# EasyEDA Pro project link board.eprj

# Schematic Schematic1
Create Date: 2024-04-27; Page Name: P1; Project Name: link board; Schematic Name: Schematic1; Update Date: 2025-11-03; Company: 嘉立创EDA; Page Size: A4; Version: V1.0
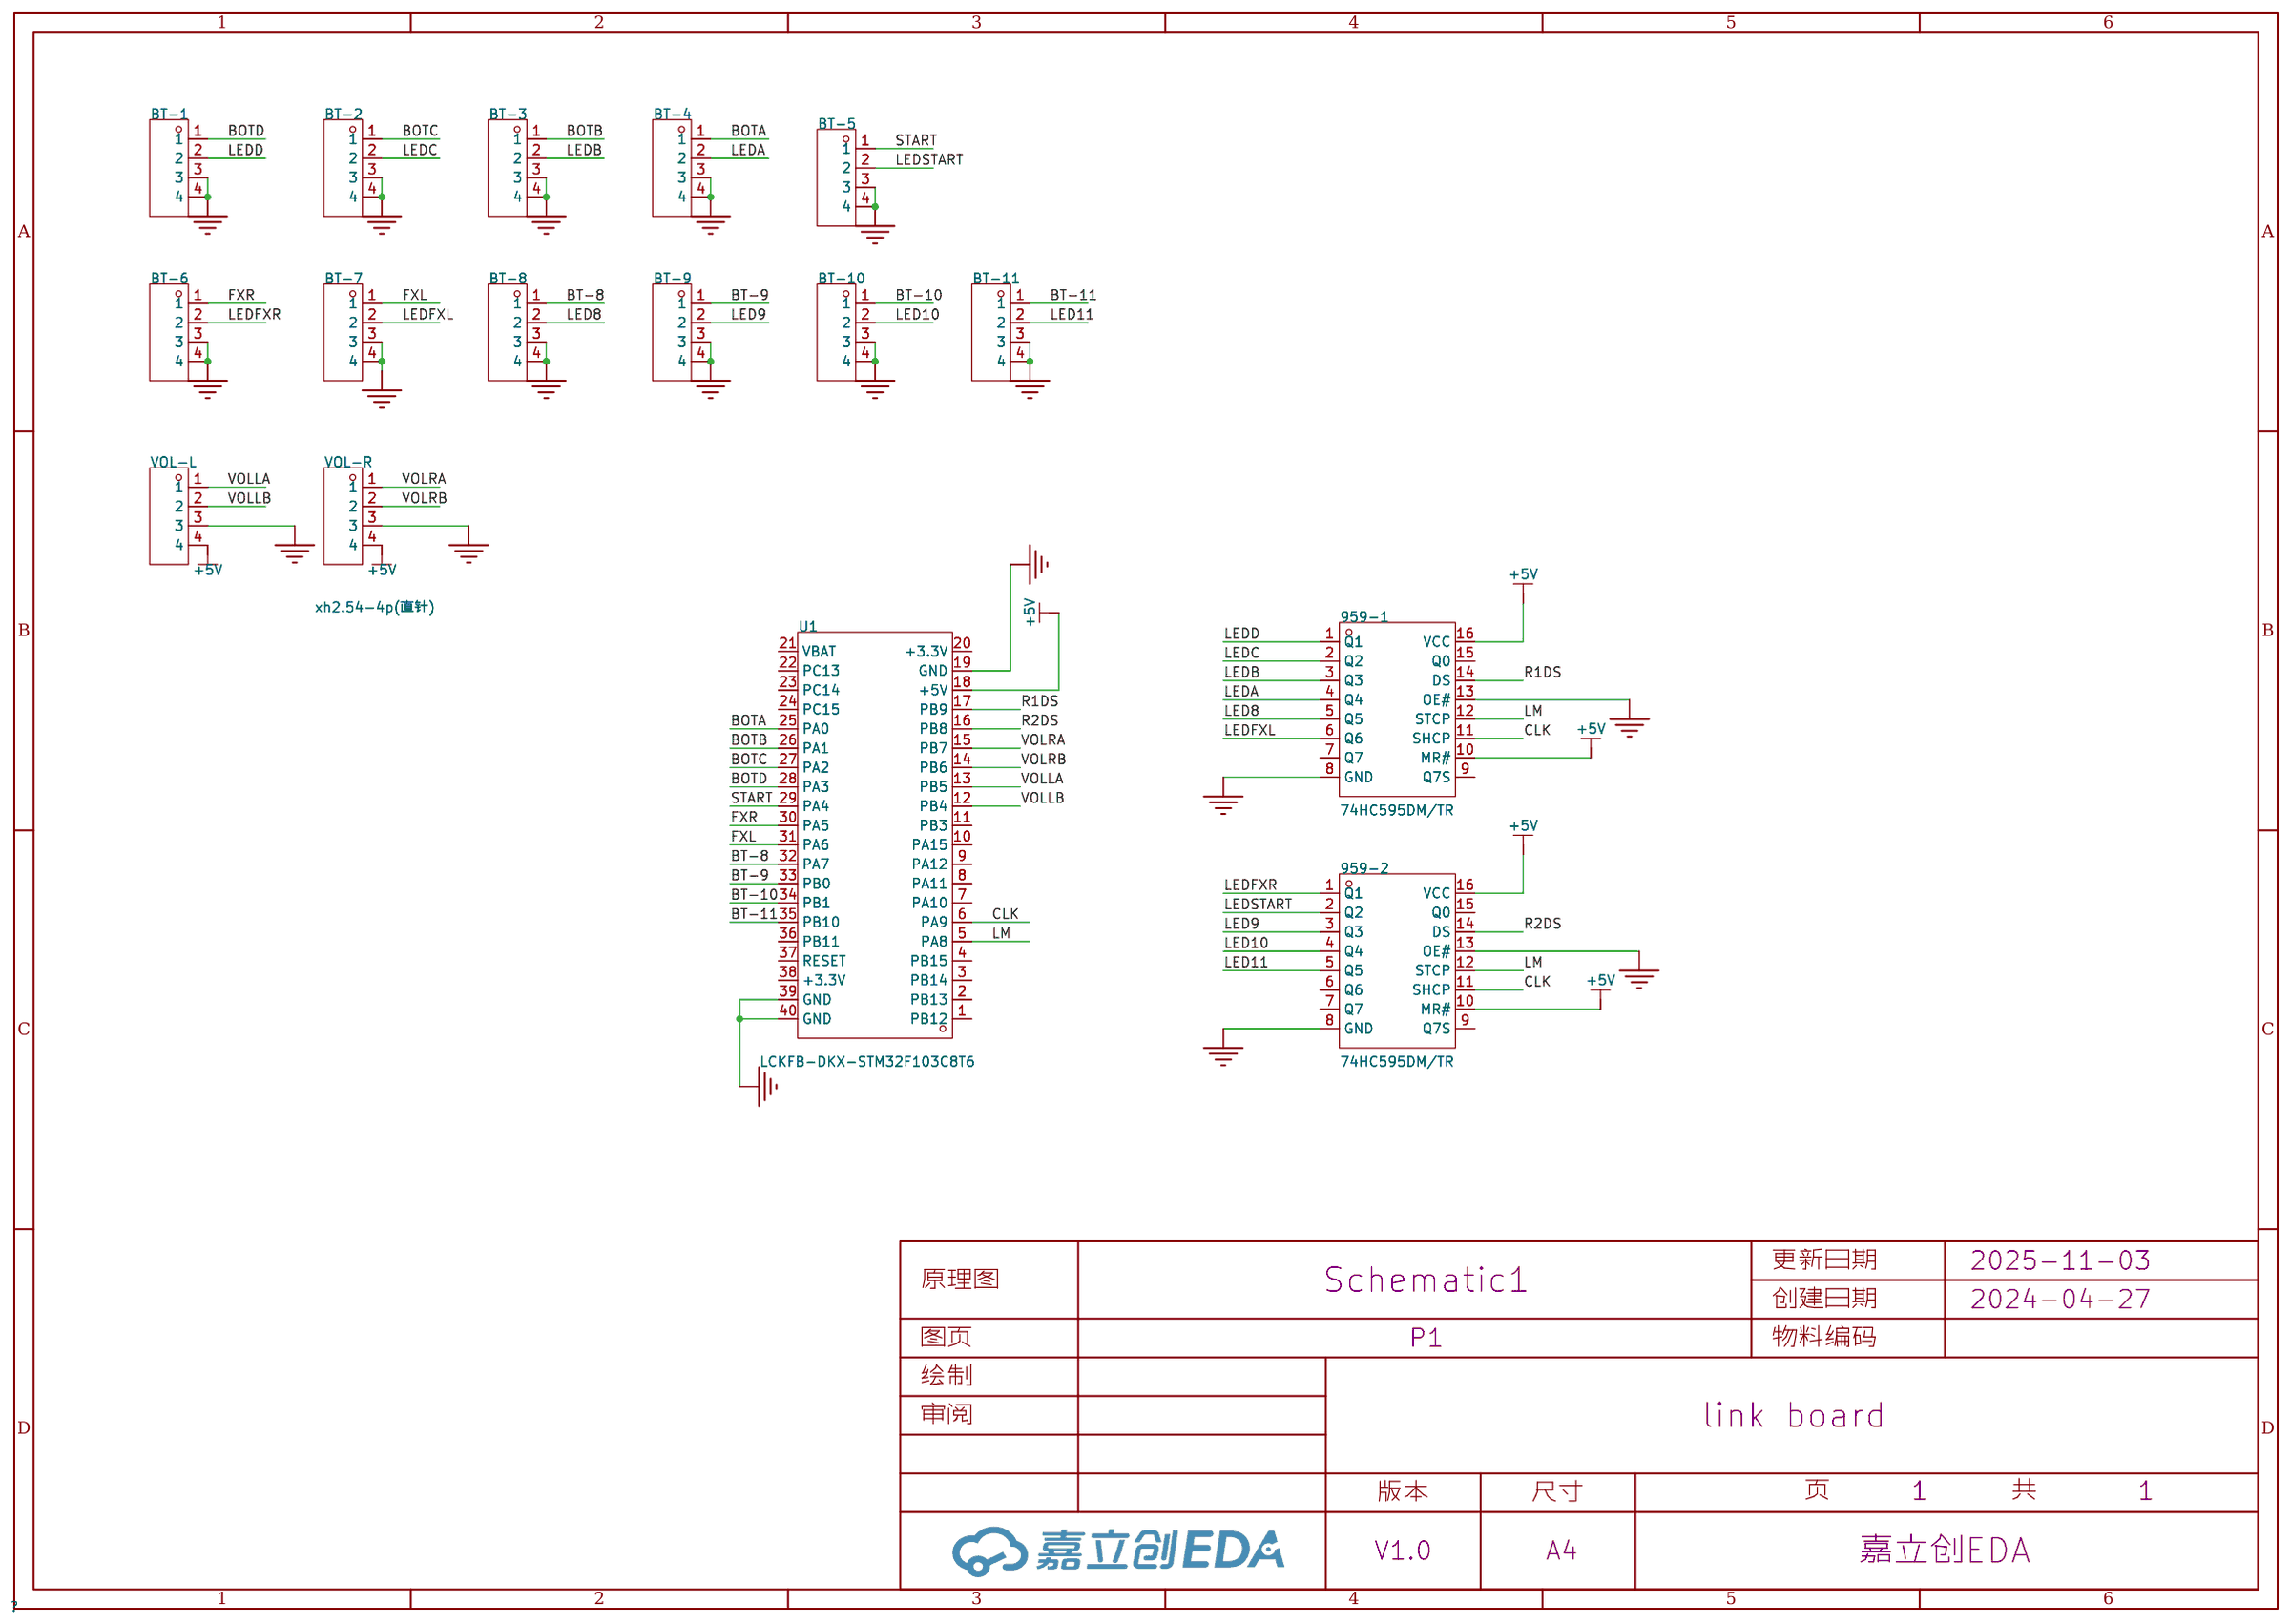
[diagram p0: schematic sheet]

## Parts
959-1  74HC595DM/TR  [SOP-16_L9.9-W3.9-P1.27-LS6.0-BL]
959-2  74HC595DM/TR  [SOP-16_L9.9-W3.9-P1.27-LS6.0-BL]
BT-1  xh2.54-4p(直针)  [CONN-TH_4P-P2.50-XH2.54-4P]
BT-2  xh2.54-4p(直针)  [CONN-TH_4P-P2.50-XH2.54-4P]
BT-3  xh2.54-4p(直针)  [CONN-TH_4P-P2.50-XH2.54-4P]
BT-4  xh2.54-4p(直针)  [CONN-TH_4P-P2.50-XH2.54-4P]
BT-5  xh2.54-4p(直针)  [CONN-TH_4P-P2.50-XH2.54-4P]
BT-6  xh2.54-4p(直针)  [CONN-TH_4P-P2.50-XH2.54-4P]
BT-7  xh2.54-4p(直针)  [CONN-TH_4P-P2.50-XH2.54-4P]
BT-8  xh2.54-4p(直针)  [CONN-TH_4P-P2.50-XH2.54-4P]
BT-9  xh2.54-4p(直针)  [CONN-TH_4P-P2.50-XH2.54-4P]
BT-10  xh2.54-4p(直针)  [CONN-TH_4P-P2.50-XH2.54-4P]
BT-11  xh2.54-4p(直针)  [CONN-TH_4P-P2.50-XH2.54-4P]
U1  LCKFB-DKX-STM32F103C8T6  [CONN-TH_L53.3-W22.9_STM32F103C8T6-CARD]
VOL-L  xh2.54-4p(直针)  [CONN-TH_4P-P2.50-XH2.54-4P]
VOL-R  xh2.54-4p(直针)  [CONN-TH_4P-P2.50-XH2.54-4P]

## Library data of the parts
959-1 959-2 = 74HC595DM/TR: 每个元件位数:8;; Supplier Part: C5310886; Manufacturer: HGSEMI(华冠); Supplier Footprint: SOP-16; JLCPCB Part Class: 扩展库; Datasheet: https://atta.szlcsc.com/upload/public/pdf/source/20230411/38690329BA06CC7DD5353F2E6349E43B.pdf; Supplier: LCSC; Number of Bits per Element: 8; Series: 74HC
BT-1-BT-11 VOL-L VOL-R = xh2.54-4p(直针): Supplier Part: C9900015350; JLCPCB Part Class: 扩展库; Supplier: LCSC
U1 = LCKFB-DKX-STM32F103C8T6: LCSC Part Name: 立创·地阔星-STM32F103C8T6开发板; Supplier Part: C22396880; Manufacturer: 立创开发板; JLCPCB Part Class: 扩展库; Datasheet: https://atta.szlcsc.com/upload/public/pdf/source/20240801/7EEF69F7480DF7C6DA98696664D658D4.pdf; Supplier: LCSC

## Nets
+5V: 959-1.10(MR#) 959-1.16(VCC) 959-2.10(MR#) 959-2.16(VCC) U1.18(+5V) VOL-L.4 VOL-R.4
GND: 959-1.8(GND) 959-1.13(OE#) 959-2.8(GND) 959-2.13(OE#) BT-1.3 BT-1.4 BT-2.3 BT-2.4 BT-3.3 BT-3.4 BT-4.3 BT-4.4 BT-5.3 BT-5.4 BT-6.3 BT-6.4 BT-7.3 BT-7.4 BT-8.3 BT-8.4 BT-9.3 BT-9.4 BT-10.3 BT-10.4 BT-11.3 BT-11.4 U1.19(GND) U1.39(GND) U1.40(GND) VOL-L.3 VOL-R.3
BOTA: BT-4.1 U1.25(PA0)
BOTB: BT-3.1 U1.26(PA1)
BOTC: BT-2.1 U1.27(PA2)
BOTD: BT-1.1 U1.28(PA3)
BT-8: BT-8.1 U1.32(PA7)
BT-9: BT-9.1 U1.33(PB0)
BT-10: BT-10.1 U1.34(PB1)
BT-11: BT-11.1 U1.35(PB10)
CLK: 959-1.11(SHCP) 959-2.11(SHCP) U1.6(PA9)
FXL: BT-7.1 U1.31(PA6)
FXR: BT-6.1 U1.30(PA5)
LED8: 959-1.5(Q5) BT-8.2
LED9: 959-2.3(Q3) BT-9.2
LED10: 959-2.4(Q4) BT-10.2
LED11: 959-2.5(Q5) BT-11.2
LEDA: 959-1.4(Q4) BT-4.2
LEDB: 959-1.3(Q3) BT-3.2
LEDC: 959-1.2(Q2) BT-2.2
LEDD: 959-1.1(Q1) BT-1.2
LEDFXL: 959-1.6(Q6) BT-7.2
LEDFXR: 959-2.1(Q1) BT-6.2
LEDSTART: 959-2.2(Q2) BT-5.2
LM: 959-1.12(STCP) 959-2.12(STCP) U1.5(PA8)
R1DS: 959-1.14(DS) U1.17(PB9)
R2DS: 959-2.14(DS) U1.16(PB8)
START: BT-5.1 U1.29(PA4)
VOLLA: U1.13(PB5) VOL-L.1
VOLLB: U1.12(PB4) VOL-L.2
VOLRA: U1.15(PB7) VOL-R.1
VOLRB: U1.14(PB6) VOL-R.2

Not connected (* = marked no-connect by the designer): 959-1 7(Q7) 9(Q7S) 15(Q0); 959-2 6(Q6) 7(Q7) 9(Q7S) 15(Q0); U1 1(PB12) 2(PB13) 3(PB14) 4(PB15) 7(PA10) 8(PA11) 9(PA12) 10(PA15) 11(PB3) 20(+3.3V) 21(VBAT) 22(PC13) 23(PC14) 24(PC15) 36(PB11) 37(RESET) 38(+3.3V)

# Board PCB1
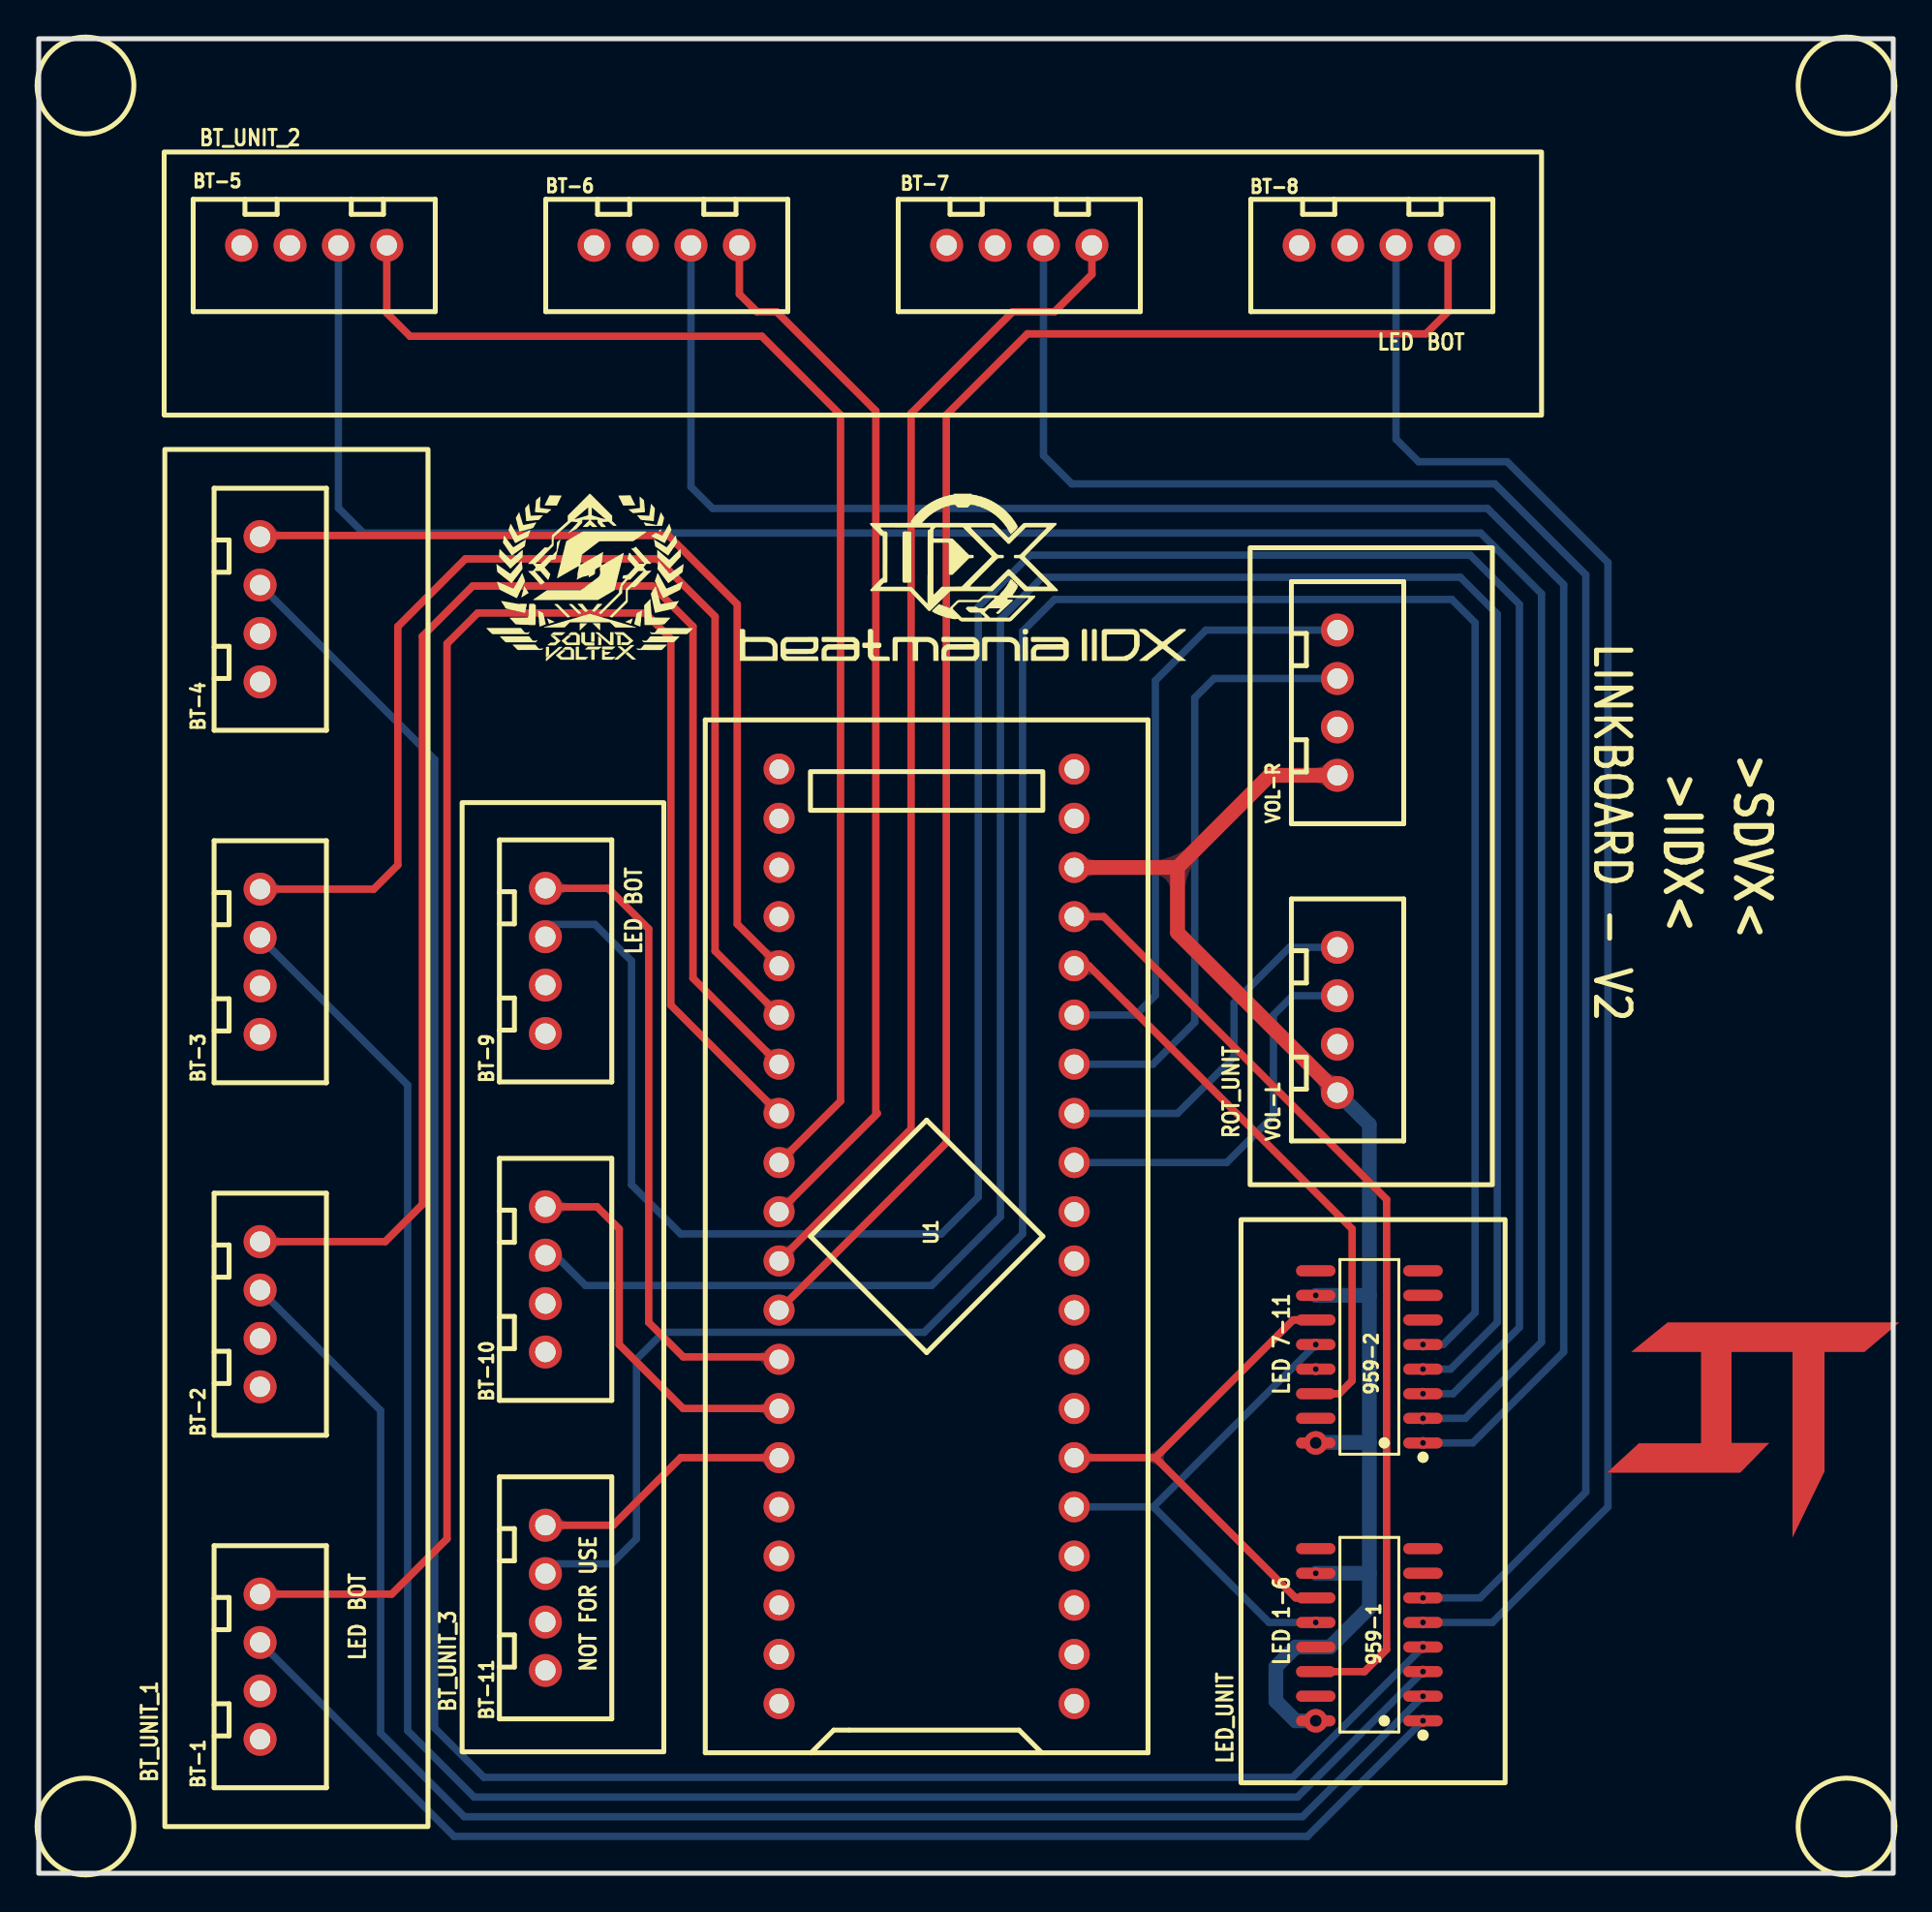
[diagram p1: board, top side]
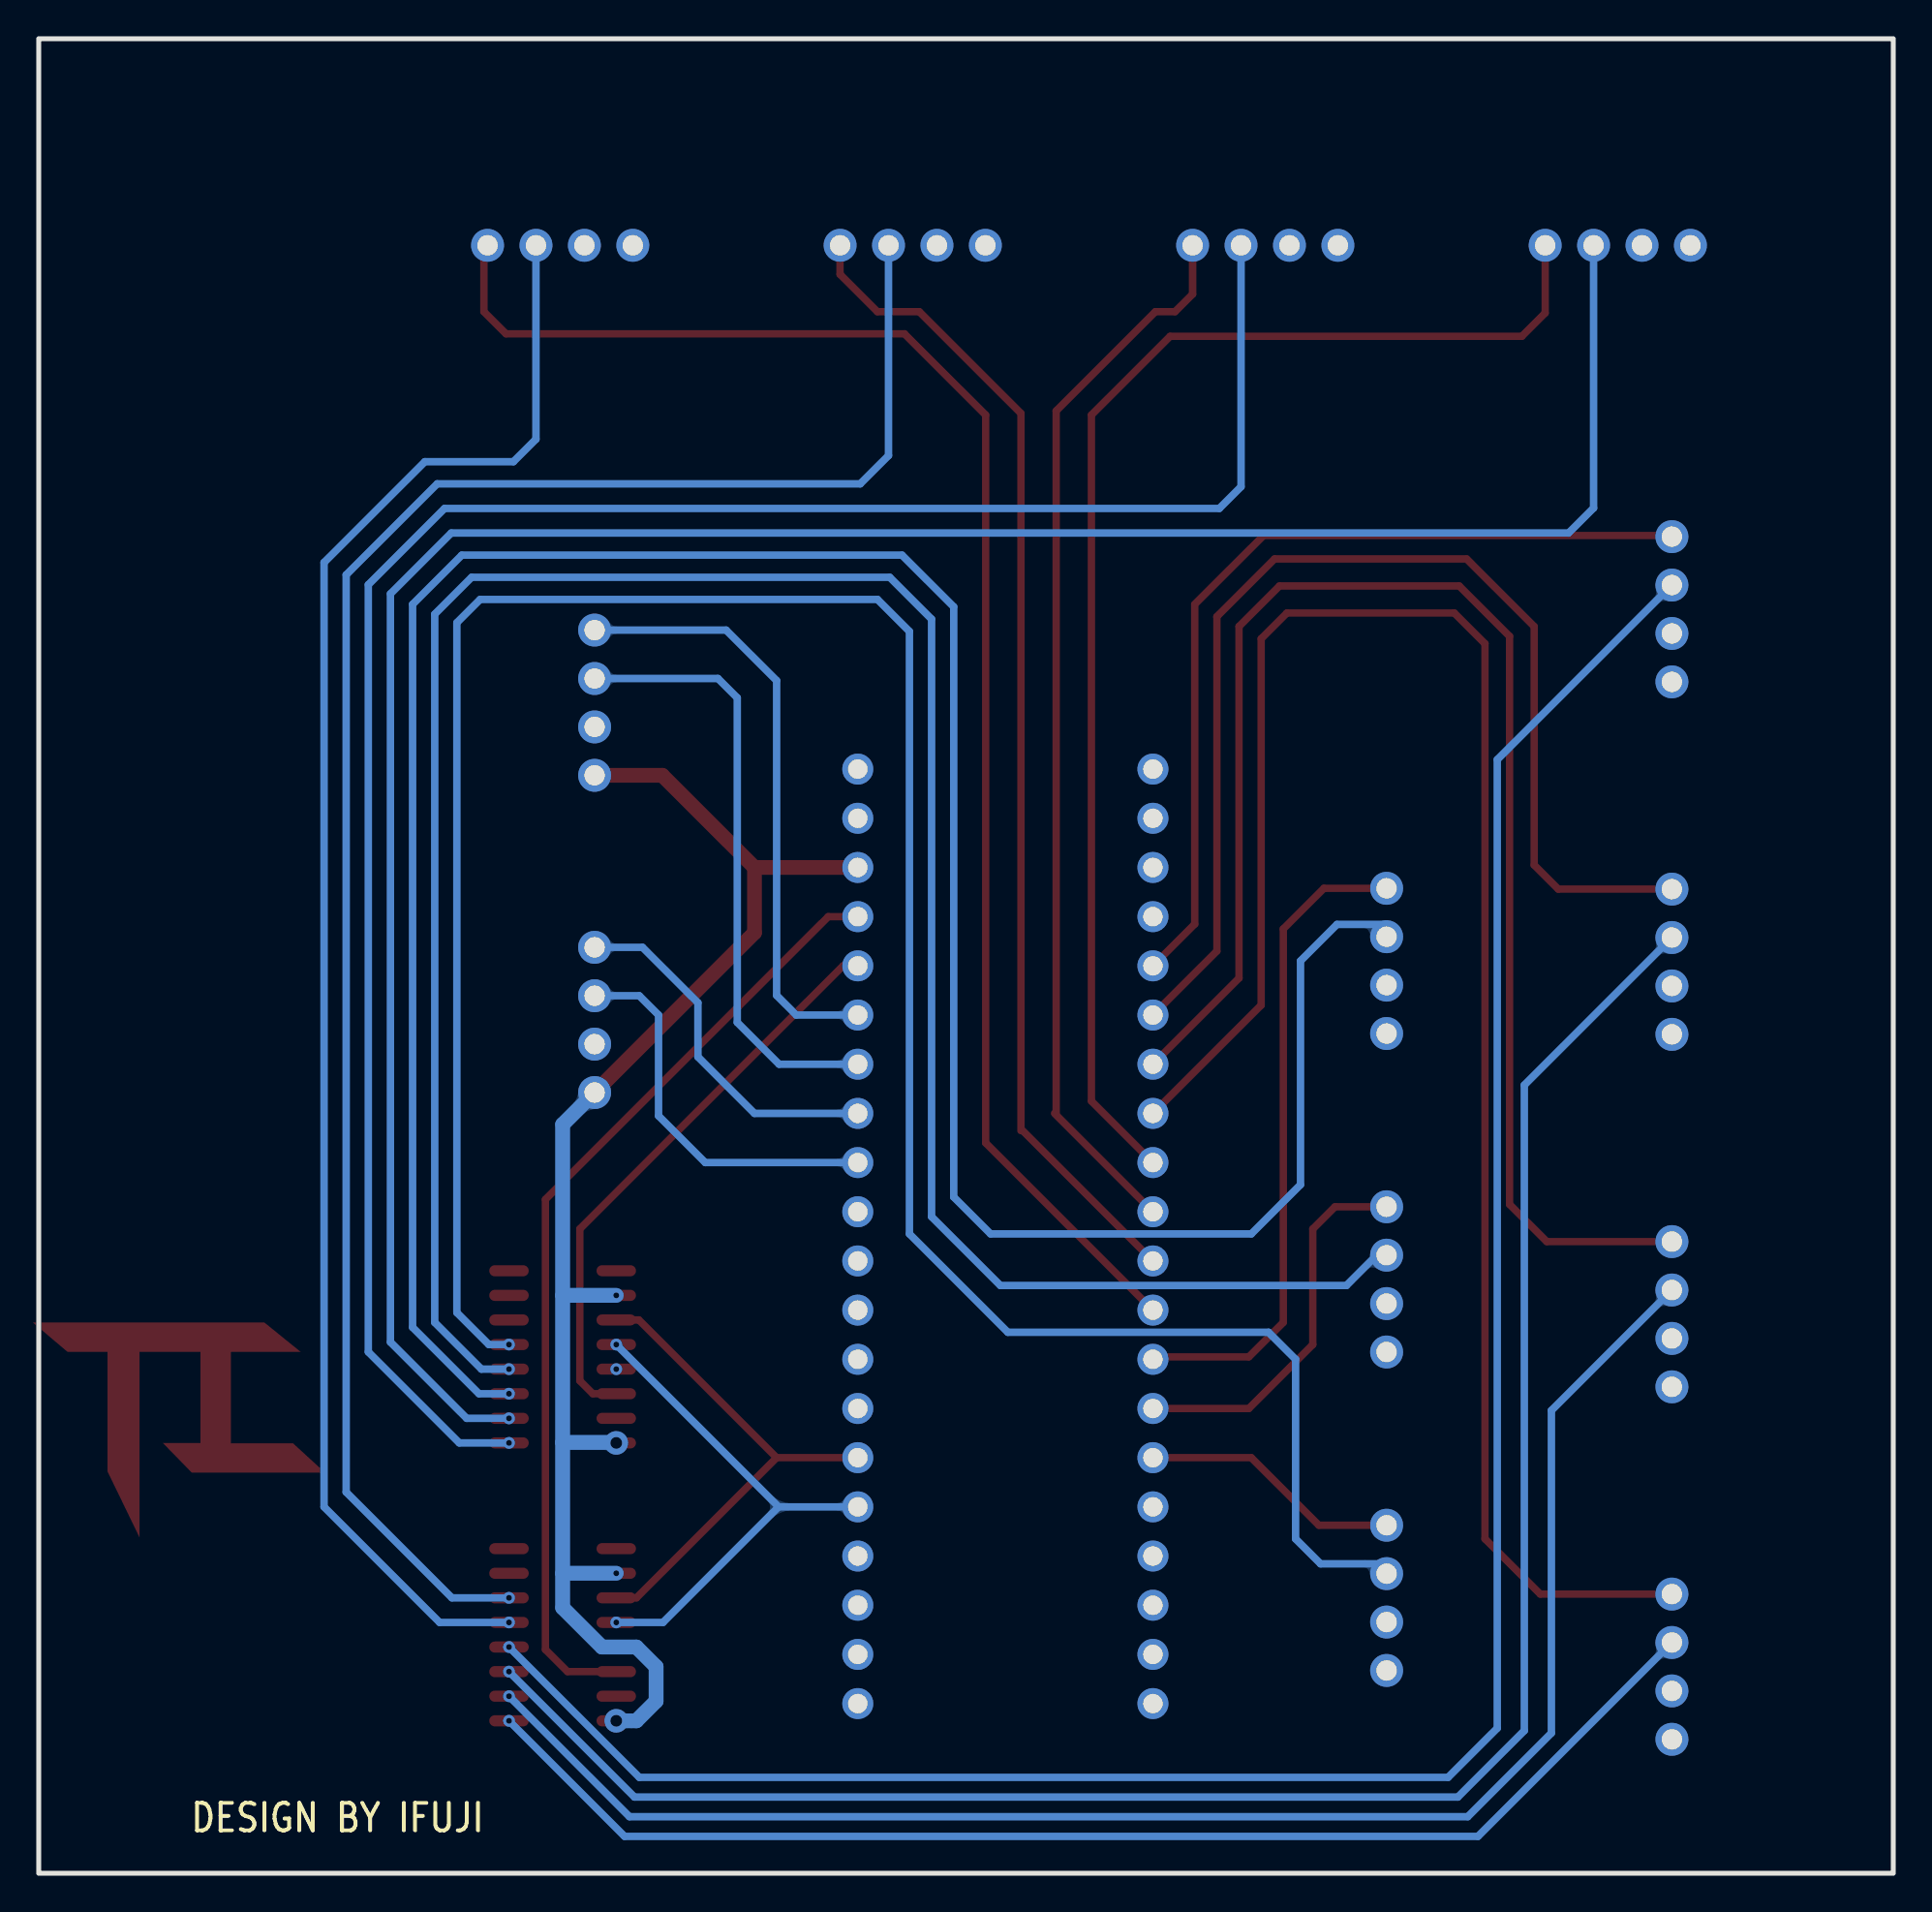
[diagram p2: board, bottom side, seen from below]

Outline 95.76 x 94.74 mm; copper layers: Top Layer, Bottom Layer. Coordinates in mm from the lower left corner of the outline.
Outline path: rectangle 0,94.74 95.76,0
Stack: Top Layer 0.035mm - / Dielectric1 1.51mm FR4 er 4.5 / Bottom Layer 0.035mm -

## Design rules (mm)
template: 自定义配置
spacing copperThickness1oz (default): track to track 0.102, other pairs 0.152 to 0.3
spacing copperThickness2oz: track to track 0.203, other pairs 0.152 to 0.3
spacing Default: track to track 0.152, other pairs 0 to 0.152
spacing 7V: track to track 0.152, other pairs 0 to 0.152
spacing 8V: track to track 0.152, other pairs 0 to 0.152
spacing 12V: track to track 0.152, other pairs 0 to 0.152
track width copperThickness1oz (default): min 0.127, default 0.254, max 2.54
track width copperThickness2oz: min 0.203, default 0.254, max 2.54
track width Default: min 0.254, default 0.254, max 25.4
track width 7V: min 1.016, default 1.016, max 25.4
track width 8V: min 1.016, default 1.016, max 25.4
track width 12V: min 1.524, default 1.524, max 25.4
differential pair differentialPair (default): width min 0.127, default 0.254, max 2.54; gap min 0.152, default 0.152
via viaSize (default): diameter min 0.5, default 0.61, max 10; hole min 0.3, default 0.305, max 6.299
via Default: diameter min 0.61, default 0.61, max 100.025; hole min 0.305, default 0.305, max 59.995
via 7V: diameter min 0.61, default 0.61, max 100.025; hole min 0.305, default 0.305, max 59.995
via 8V: diameter min 0.61, default 0.61, max 100.025; hole min 0.305, default 0.305, max 59.995
via 12V: diameter min 0.61, default 0.61, max 100.025; hole min 0.305, default 0.305, max 59.995
net GND uses gge27351

## Placement (name value [footprint] x y rotation side)
959-1  74HC595DM/TR  [SOP-16_L9.9-W3.9-P1.27-LS6.0-BL]  68.71 12.32 90 top
959-2  74HC595DM/TR  [SOP-16_L9.9-W3.9-P1.27-LS6.0-BL]  68.71 26.67 90 top
BT-1  xh2.54-4p(直针)  [CONN-TH_4P-P2.50-XH2.54-4P]  11.43 10.67 90 top
BT-2  xh2.54-4p(直针)  [CONN-TH_4P-P2.50-XH2.54-4P]  11.43 28.87 90 top
BT-3  xh2.54-4p(直针)  [CONN-TH_4P-P2.50-XH2.54-4P]  11.43 47.07 90 top
BT-4  xh2.54-4p(直针)  [CONN-TH_4P-P2.50-XH2.54-4P]  11.43 65.28 90 top
BT-5  xh2.54-4p(直针)  [CONN-TH_4P-P2.50-XH2.54-4P]  14.22 84.07 0 top
BT-6  xh2.54-4p(直针)  [CONN-TH_4P-P2.50-XH2.54-4P]  32.43 84.07 0 top
BT-7  xh2.54-4p(直针)  [CONN-TH_4P-P2.50-XH2.54-4P]  50.63 84.07 0 top
BT-8  xh2.54-4p(直针)  [CONN-TH_4P-P2.50-XH2.54-4P]  68.83 84.07 0 top
BT-9  xh2.54-4p(直针)  [CONN-TH_4P-P2.50-XH2.54-4P]  26.16 47.12 90 top
BT-10  xh2.54-4p(直针)  [CONN-TH_4P-P2.50-XH2.54-4P]  26.16 30.67 90 top
BT-11  xh2.54-4p(直针)  [CONN-TH_4P-P2.50-XH2.54-4P]  26.16 14.22 90 top
NOREF  -  [Pad_e56]  88.52 27.69 90 top
U1  LCKFB-DKX-STM32F103C8T6  [CONN-TH_L53.3-W22.9_STM32F103C8T6-CARD]  45.85 32.89 90 top
VOL-L  xh2.54-4p(直针)  [CONN-TH_4P-P2.50-XH2.54-4P]  67.06 44.07 90 top
VOL-R  xh2.54-4p(直针)  [CONN-TH_4P-P2.50-XH2.54-4P]  67.06 60.45 90 top

## Footprints (pads in the part's own frame, mm; a bottom-side part is the same pattern mirrored in y, then rotated)
CONN-TH_4P-P2.50-XH2.54-4P
  round 1.7 hole 1.05: 1(3.75,0) 2(1.25,0) 3(-1.25,0) 4(-3.75,0)
CONN-TH_L53.3-W22.9_STM32F103C8T6-CARD
  round 1.6 hole 1: 1(-24.13,-7.62) 2(-21.59,-7.62) 3(-19.05,-7.62) 4(-16.51,-7.62) 5(-13.97,-7.62) 6(-11.43,-7.62) 7(-8.89,-7.62) 8(-6.35,-7.62) 9(-3.81,-7.62) 10(-1.27,-7.62) 11(1.27,-7.62) 12(3.81,-7.62) 13(6.35,-7.62) 14(8.89,-7.62) 15(11.43,-7.62) 16(13.97,-7.62) 17(16.51,-7.62) 18(19.05,-7.62) 19(21.59,-7.62) 20(24.13,-7.62) 21(24.13,7.62) 22(21.59,7.62) 23(19.05,7.62) 24(16.51,7.62) 25(13.97,7.62) 26(11.43,7.62) 27(8.89,7.62) 28(6.35,7.62) 29(3.81,7.62) 30(1.27,7.62) 31(-1.27,7.62) 32(-3.81,7.62) 33(-6.35,7.62) 34(-8.89,7.62) 35(-11.43,7.62) 36(-13.97,7.62) 37(-16.51,7.62) 38(-19.05,7.62) 39(-21.59,7.62) 40(-24.13,7.62)
Pad_e56
  custom 11.107x15.095 smd: 41(0,0)
SOP-16_L9.9-W3.9-P1.27-LS6.0-BL
  oval 0.574x2.038 smd: 1(-4.445,-2.769) 2(-3.175,-2.769) 3(-1.905,-2.769) 4(-0.635,-2.769) 5(0.635,-2.769) 6(1.905,-2.769) 7(3.175,-2.769) 8(4.445,-2.769) 9(4.445,2.769) 10(3.175,2.769) 11(1.905,2.769) 12(0.635,2.769) 13(-0.635,2.769) 14(-1.905,2.769) 15(-3.175,2.769) 16(-4.445,2.769)

## Nets
As in the schematic, except:
GND: 959-1.8 959-1.13 959-2.8 959-2.13 BT-1.3 BT-1.4 BT-2.3 BT-2.4 BT-3.3 BT-3.4 BT-4.3 BT-4.4 BT-5.3 BT-5.4 BT-6.3 BT-6.4 BT-7.3 BT-7.4 BT-8.3 BT-8.4 BT-9.3 BT-9.4 BT-10.3 BT-10.4 BT-11.3 BT-11.4 NOREF.41 U1.19 U1.39 U1.40 VOL-L.3 VOL-R.3

Pads without a net: 959-1 7 9 15; 959-2 6 7 9 15; U1 1 2 3 4 7 8 9 10 11 20 21 22 23 24 36 37 38

## Via types
v1: diameter 0.61, hole 0.305, Top Layer to Bottom Layer, 16 vias
v2: diameter 1.219, hole 0.61, Top Layer to Bottom Layer, 2 vias

## Routing (per net, layer and track width the routed paths; a pad name or vN(x,y) marks a point on that pad's centre or on a via; arc(x,y) is an arc through that point)
+5V: length 76.5
  Top Layer w0.762: VOL-R.4 63.56,56.7 58.8,51.94 ; 58.8,51.94 U1.18 ; 58.8,51.94 58.8,48.57 VOL-L.4
  Bottom Layer w0.762: 68.71,15.49 68.71,13.72 66.68,11.68 64.9,11.68 63.88,10.67 63.88,8.89 64.9,7.87 65.91,7.87 ; 68.71,15.49 v1(65.94,15.49) ; 68.71,15.49 68.71,22.25 ; 68.71,22.25 65.96,22.25 v2(65.94,22.22) ; 68.71,22.25 68.71,29.84 ; 68.71,29.84 v1(65.94,29.84) ; 68.71,29.84 68.71,38.67 VOL-L.4
  vias: v2(65.94,7.87)
GND:
  vias: v1(65.94,26.03)
BOTA: length 45.7
  Top Layer w0.381: U1.25 36.07,49.02 36.07,65.53 32.51,69.09 11.49,69.09 BT-4.1
BOTB: length 61
  Top Layer w0.381: U1.26 34.93,47.62 34.93,64.9 31.94,67.88 22.03,67.88 18.54,64.39 18.54,52.07 17.3,50.82 11.43,50.82
BOTC: length 78.9
  Top Layer w0.381: U1.27 33.78,46.23 33.78,64.39 31.69,66.48 22.41,66.48 19.81,63.88 19.81,34.54 17.89,32.62 BT-2.1
BOTD: length 96.7
  Top Layer w0.381: BT-1.1 18.23,14.42 21.08,17.27 21.08,63.5 22.67,65.08 31.31,65.08 32.64,63.75 32.64,44.83 U1.28
BT-8: length 81.4
  Top Layer w0.381: U1.32 46.86,37.72 46.86,75.31 51.05,79.5 71.63,79.5 72.77,80.64 72.77,83.89 BT-8.1
BT-9: length 34
  Top Layer w0.381: U1.33 38.1,26.67 33.27,26.67 31.5,28.45 31.5,48.77 29.4,50.87 BT-9.1
BT-10: length 19.9
  Top Layer w0.381: BT-10.1 28.83,34.42 29.97,33.27 29.97,27.3 33.27,24 U1.34
BT-11: length 13.5
  Top Layer w0.381: BT-11.1 29.66,17.97 33.15,21.46 U1.35
CLK: length 26.7
  Top Layer w0.381: 959-1.11 64.9,14.22 57.66,21.46 ; U1.6 57.66,21.46 ; 57.66,21.46 64.77,28.57 959-2.11
FXL: length 60.4
  Top Layer w0.381: 45.04,38.35 45.04,75.4 50.29,80.64 52.45,80.64 54.38,82.57 BT-7.1 ; 44.96,38.35 U1.31
FXR: length 55.5
  Top Layer w0.381: U1.30 43.31,39.24 ; BT-6.1 36.18,81.55 37.08,80.64 38.1,80.64 43.22,75.52 43.22,39.24
LED8: length 84.4
  Bottom Layer w0.381: BT-8.2 70.08,74.06 71.25,72.9 75.82,72.9 81.03,67.69 81.03,18.92 75.06,12.95 v1(71.48,12.95)
LED9: length 140.8
  Bottom Layer w0.381: v1(71.48,24.76) 73.03,24.76 76.45,28.19 76.45,65.53 73.91,68.07 51.18,68.07 48.51,65.4 48.51,34.92 46.61,33.02 33.15,33.02 30.61,35.56 30.61,47.12 28.72,49 26.16,49
LED10: length 125.4
  Bottom Layer w0.381: v1(71.48,26.03) 72.9,26.03 75.31,28.45 75.31,65.02 73.41,66.93 51.82,66.93 49.66,64.77 49.66,33.91 46.1,30.35 28.24,30.35 26.16,32.43
LED11: length 131.8
  Bottom Layer w0.381: v1(71.48,27.3) 72.52,27.3 74.17,28.96 74.17,64.58 72.96,65.79 52.45,65.79 50.8,64.13 50.8,33.02 45.72,27.94 32.26,27.94 30.86,26.54 30.86,17.27 29.57,15.98 26.16,15.98
LEDA: length 117.6
  Bottom Layer w0.381: BT-4.2 20.45,57.51 20.45,7.49 22.99,4.95 64.75,4.95 v1(71.48,11.68)
LEDB: length 100.6
  Bottom Layer w0.381: v1(71.48,10.41) 65,3.94 22.48,3.94 19.05,7.37 19.05,40.7 BT-3.2
LEDC: length 83.6
  Bottom Layer w0.381: v1(71.48,9.14) 65.25,2.92 21.97,2.92 17.65,7.24 17.65,23.9 BT-2.2
LEDD: length 66.7
  Bottom Layer w0.381: BT-1.2 21.44,1.91 65.51,1.91 v1(71.48,7.87)
LEDFXL: length 99.5
  Bottom Layer w0.381: v1(71.48,14.22) 74.42,14.22 79.88,19.69 79.88,67.06 75.18,71.75 53.34,71.75 51.88,73.21 BT-7.2
LEDFXR: length 108.5
  Bottom Layer w0.381: v1(71.48,22.22) 74.04,22.22 78.74,26.92 78.74,66.55 74.8,70.48 34.8,70.48 33.68,71.61 BT-6.2
LEDSTART: length 123.9
  Bottom Layer w0.381: BT-5.2 15.47,70.5 16.76,69.21 74.46,69.21 77.6,66.07 77.6,27.43 73.66,23.49 v1(71.48,23.49)
LM: length 26.8
  Bottom Layer w0.381: 57.56,18.92 v1(65.94,27.3) ; 57.56,18.92 63.53,12.95 v1(65.94,12.95) ; 57.56,18.92 U1.5
R1DS: length 49.6
  Top Layer w0.381: 959-1.14 68.45,10.41 69.6,11.56 69.6,34.8 54.99,49.4 U1.17
R2DS: length 30
  Top Layer w0.381: 959-2.14 67.15,24.76 67.82,25.44 67.82,33.27 54.23,46.86 U1.16
START: length 69
  Top Layer w0.381: BT-5.1 17.97,80.58 19.18,79.37 37.34,79.37 41.4,75.31 41.4,39.88 U1.29
VOLLA: length 18.8
  Bottom Layer w0.381: VOL-L.1 64.58,47.82 61.72,44.96 61.72,42.16 58.8,39.24 U1.13
VOLLB: length 20.2
  Bottom Layer w0.381: VOL-L.2 64.75,45.32 63.75,44.32 63.75,39.12 61.34,36.7 U1.12
VOLRA: length 31.3
  Bottom Layer w0.381: U1.15 56.64,44.32 57.66,45.34 57.66,61.59 60.26,64.2 VOL-R.1
VOLRB: length 31.7
  Bottom Layer w0.381: U1.14 57.53,41.78 59.69,43.94 59.69,60.71 60.69,61.7 VOL-R.2

## Copper pours and planes (outline as drawn; the poured copper is in the pictures)
GND on Top Layer: 0,94.74 95.76,94.74 95.76,0 0,0
GND on Bottom Layer: -0.13,94.87 95.63,94.87 95.63,0.13 -0.13,0.13

Small or netless copper shapes (teardrops, artwork), in the pictures only: 29 on Top Layer, 29 on Bottom Layer

## Text on the board
Bottom Silkscreen Layer: DESIGN BY IFUJI
Top Silkscreen Layer: BT_UNIT_2 | LED | BOT | NOT FOR USE | ROT_UNIT | BT_UNIT_3 | LED_UNIT | LED 7-11 | LED 1-6 | BT_UNIT_1 | LINKBOARD - V2 | >IIDX< | >SDVX<

# Board PCB_PCB_工训赛2023（底板）_2024-09-09
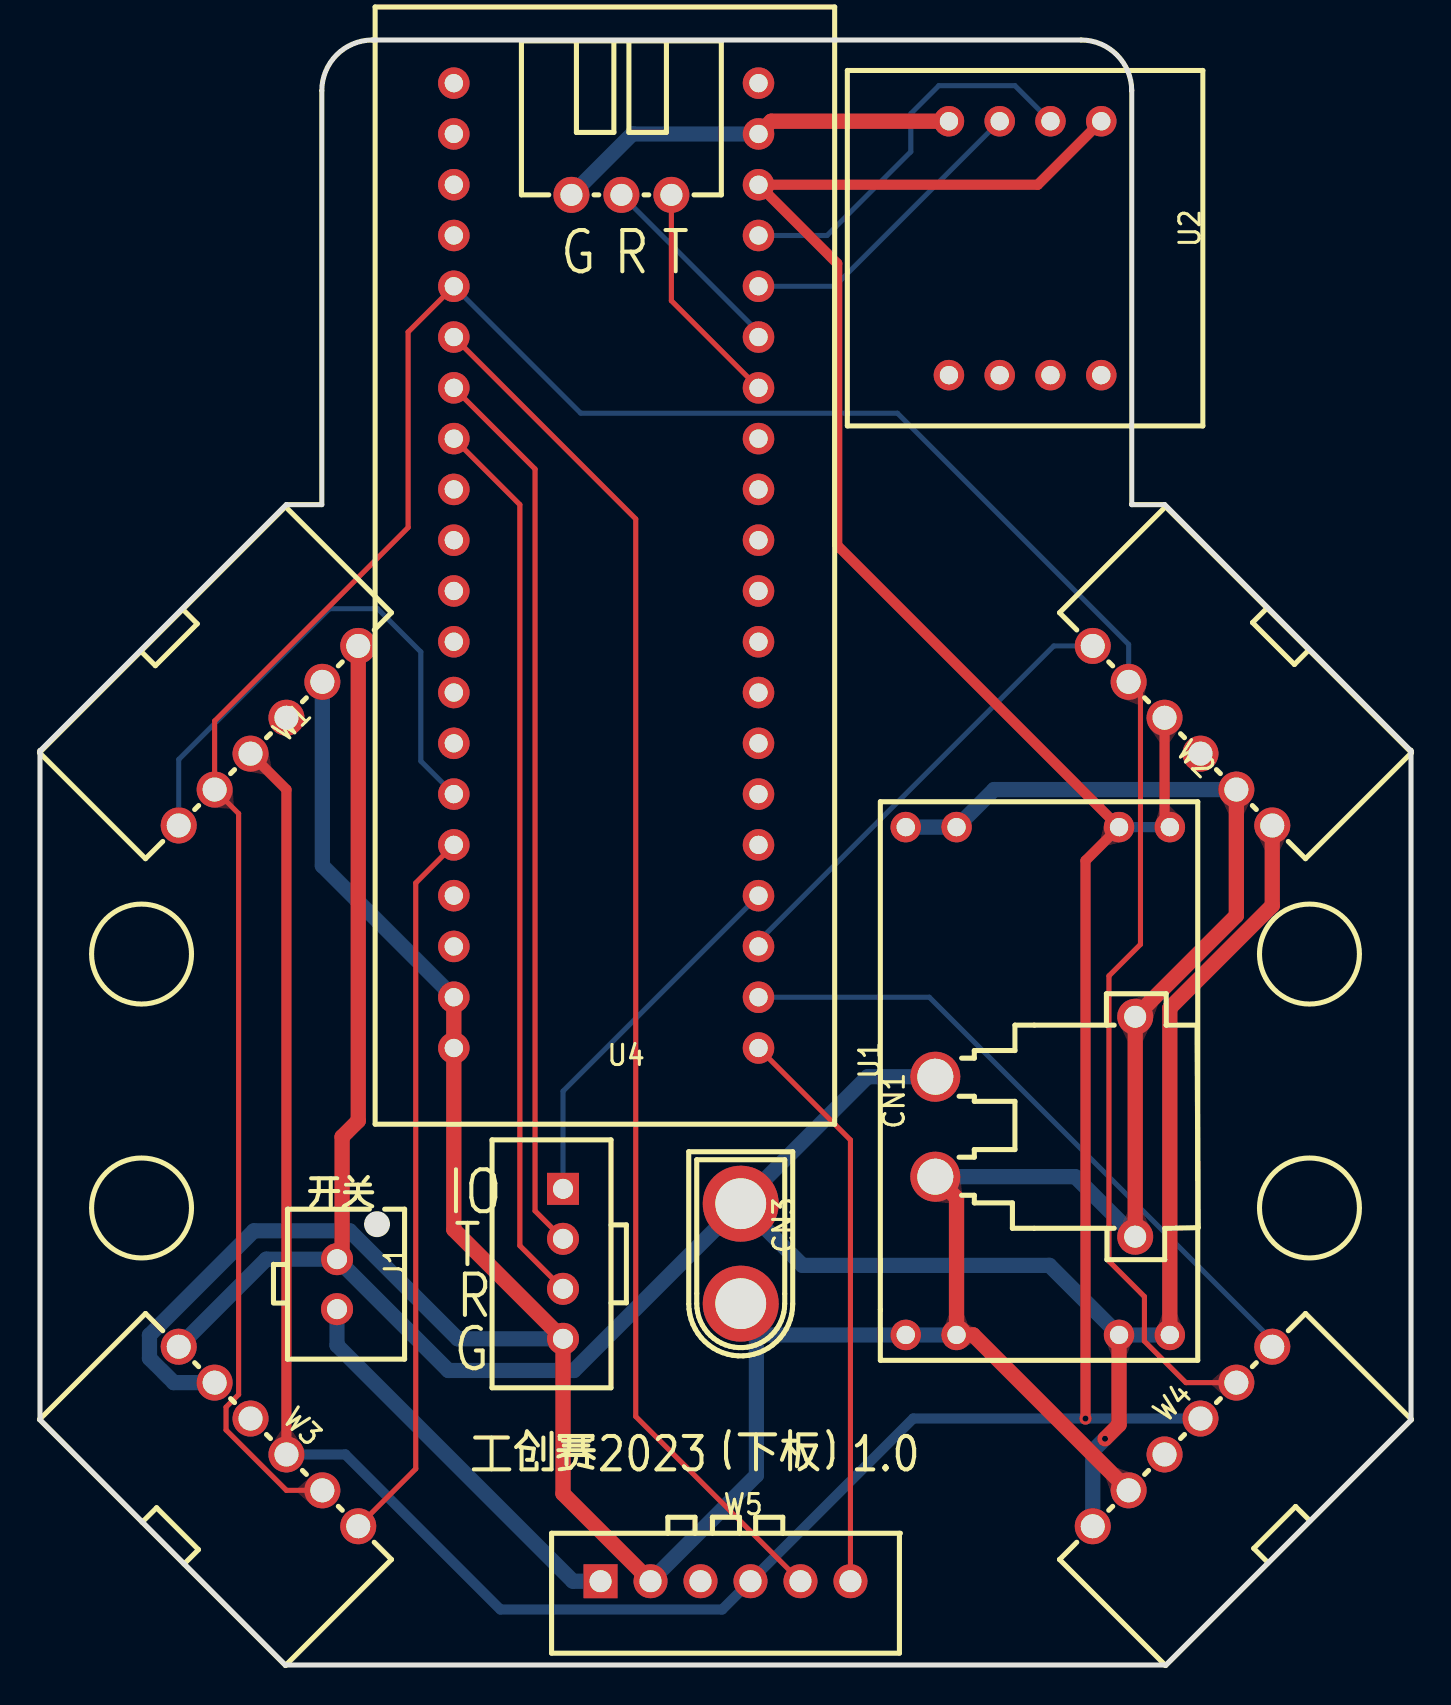
[diagram p3: board, top side]
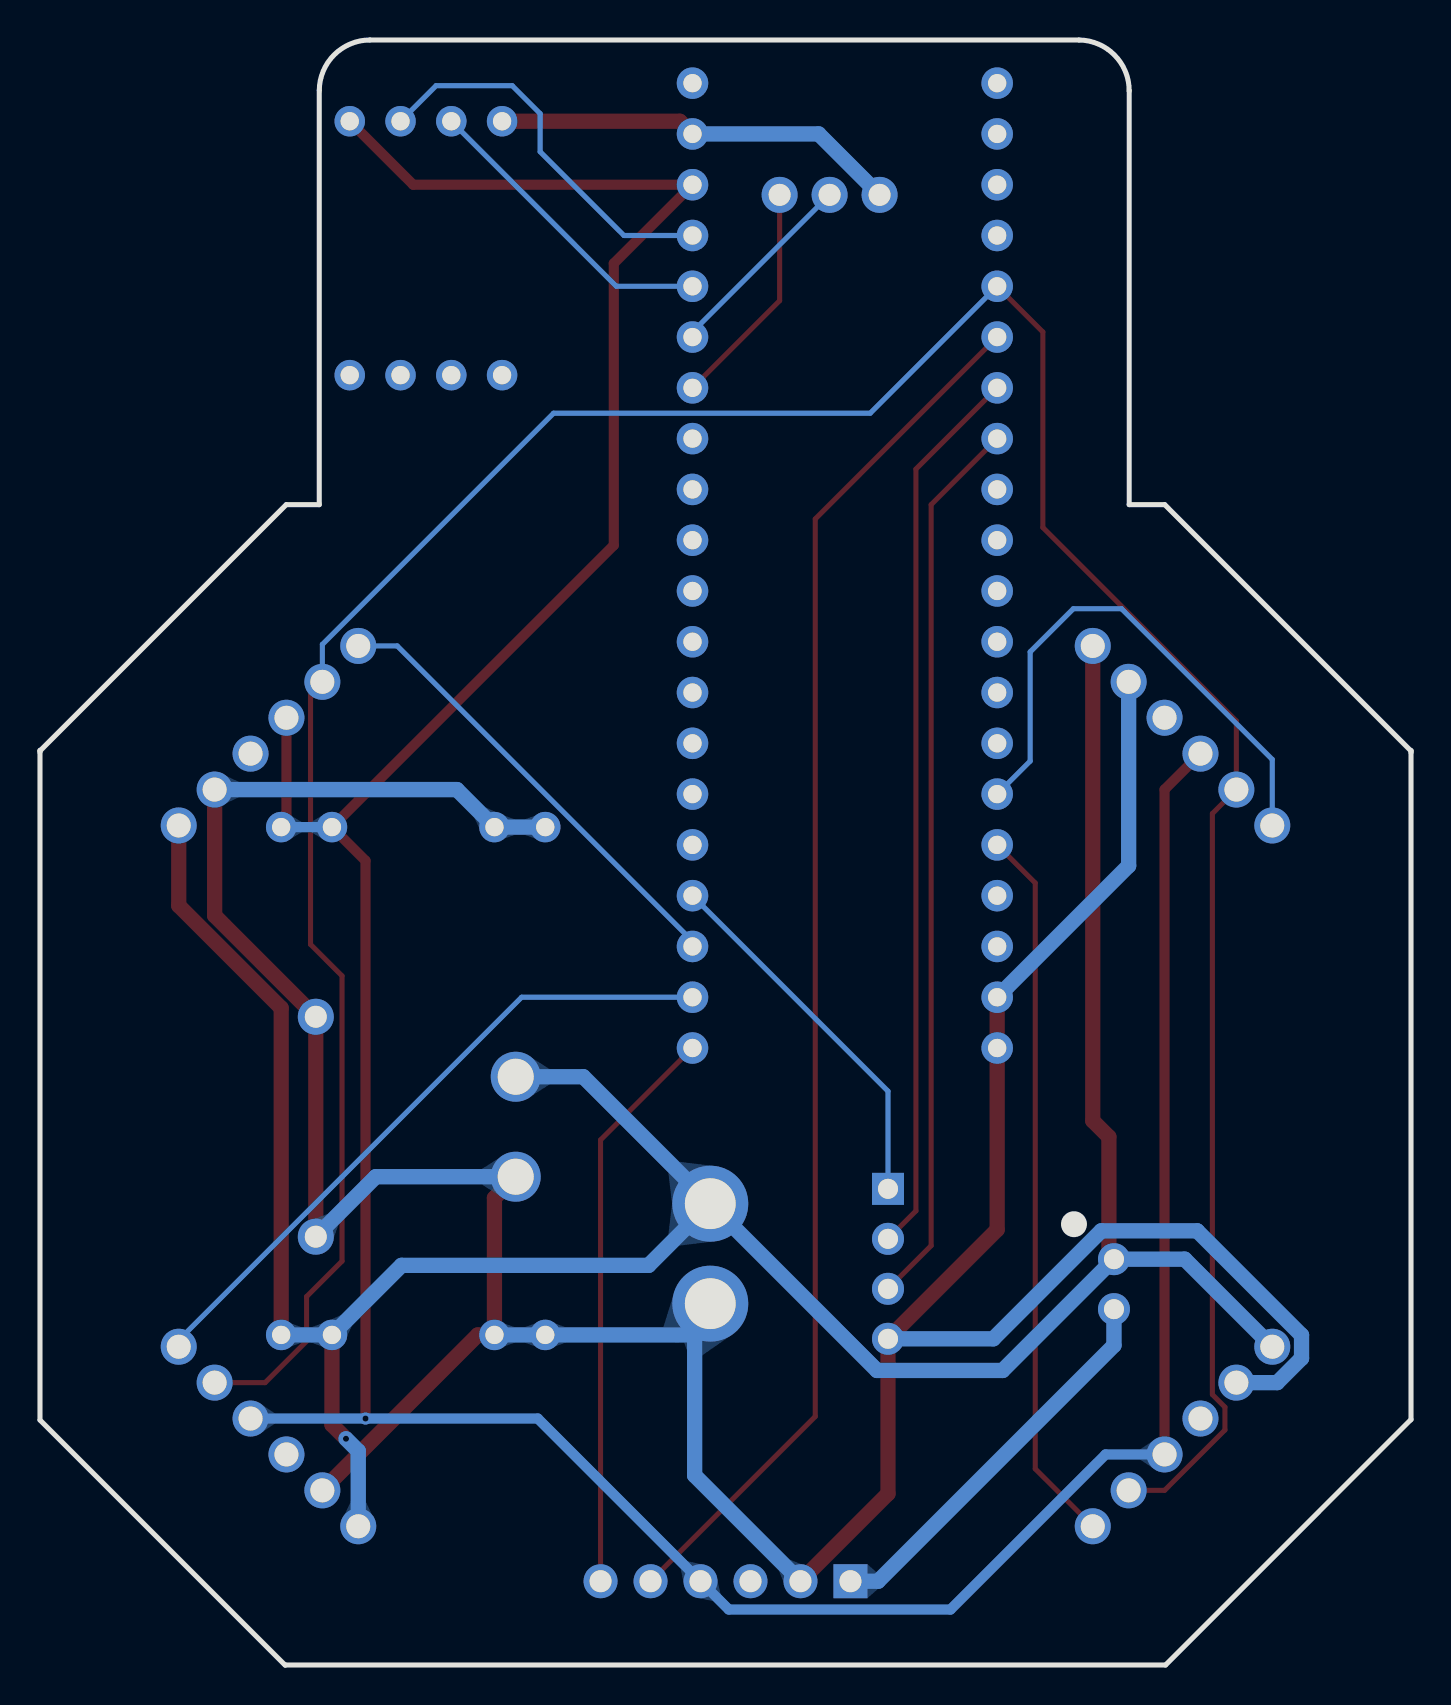
[diagram p4: board, bottom side, seen from below]

Outline 68.58 x 81.28 mm; copper layers: Top Layer, Bottom Layer. Coordinates in mm from the lower left corner of the outline.
Outline path: 0,45.63 0,45.72 12.32,58.04 14.1,58.04 14.1,78.75 arc(14.84,80.53) 16.62,81.28 52.08,81.28 arc(53.86,80.54) 54.61,78.76 54.61,58.04 56.26,58.04 68.58,45.72 68.58,45.65 ; 0,45.75 0,12.28 12.28,0 56.31,0 56.3,0 ; 56.33,0 68.58,12.25 68.58,45.76
Stack: Top Layer 0.035mm / Dielectric1 1.51mm FR4 er 4.5 / Bottom Layer 0.035mm

## Design rules (mm)
spacing Default (default): track to track 0.152, other pairs 0 to 0.152
spacing 5v: track to track 0.152, other pairs 0 to 0.152
spacing 12v: track to track 0.152, other pairs 0 to 0.152
spacing GND: track to track 0.152, other pairs 0 to 0.152
track width Default (default): min 0.254, default 0.254, max 25.4
track width 5v: min 0.508, default 0.508, max 25.4
track width 12v: min 0.762, default 0.762, max 25.4
track width GND: min 0.762, default 0.762, max 25.4
differential pair differentialPair (default): width min 0.127, default 0.254, max 2.54; gap min 0.152, default 0.152
via Default (default): diameter min 0.61, default 0.61, max 100.025; hole min 0.305, default 0.305, max 59.995
via 5v: diameter min 0.61, default 0.61, max 100.025; hole min 0.305, default 0.305, max 59.995
via 12v: diameter min 0.61, default 0.61, max 100.025; hole min 0.305, default 0.305, max 59.995
via GND: diameter min 0.61, default 0.61, max 100.025; hole min 0.305, default 0.305, max 59.995
net +5V uses 5v
net +12V uses 12v
net +12VON uses 12v
net GND uses GND, gge6169
pour e103 uses gge6175
pour e194 uses gge6169

## Placement (name value [footprint] x y rotation side)
CN1  电源  [CONN-TH_XT30PW-M]  49.78 26.92 90 top
CN3  XT30U-M  [CONN-TH_XT30U-M]  35.05 20.57 270 top
H11  上板通讯  [CONN-TH_4P-P2.50_HX25035-4A]  26.16 20.07 270 top
H12  调试端口  [CONN-TH_3P-P2.50_HX25003-3WAP]  29.08 73.53 180 top
J1  转盘电机开关  [CONN-TH_P2.50_HX25035-2BH]  14.86 19.05 270 top
U1  稳压模块  [DC-DC MINI 560]  53.47 26.67 90 top
U2  -  [陀螺仪模块（串口）]  45.47 72.14 270 top
U4  -  [STM32F103C8T6]  28.32 54.99 180 top
W1  轮1  [CONN-TH_6P-P2.50_HX25035-6WAP]  11.43 46.48 225 top
W2  轮2  [CONN-TH_6P-P2.50_HX25035-6WAP]  57.15 46.48 135 top
W3  轮3  [CONN-TH_6P-P2.50_HX25035-6WAP]  11.43 11.43 315 top
W4  轮4  [CONN-TH_6P-P2.50_HX25035-6WAP]  57.15 11.43 45 top
W5  轮5  [CONN-TH_6P-P2.50_HX25035-6A]  34.29 4.19 0 top

## Footprints (pads in the part's own frame, mm; a bottom-side part is the same pattern mirrored in y, then rotated)
CONN-TH_3P-P2.50_HX25003-3WAP
  round 1.8 hole 1.1: 1(-2.5,0) 2(0,0) 3(2.5,0)
CONN-TH_4P-P2.50_HX25035-4A
  rect 1.6x1.6 hole 1: 1(-3.75,0)
  round 1.6 hole 1: 2(-1.25,0) 3(1.25,0) 4(3.75,0)
CONN-TH_6P-P2.50_HX25035-6A
  rect 1.7x1.7 hole 1.1: 1(-6.25,0)
  round 1.7 hole 1.1: 2(-3.75,0) 3(-1.25,0) 4(1.25,0) 5(3.75,0) 6(6.25,0)
CONN-TH_6P-P2.50_HX25035-6WAP
  round 1.8 hole 1.2: 1(-6.35,0) 2(-3.81,0) 3(-1.27,0) 4(1.27,0) 5(3.81,0) 6(6.35,0)
CONN-TH_P2.50_HX25035-2BH
  round 1.6 hole 1: 1(1.25,0) 2(-1.25,0)
CONN-TH_XT30PW-M
  round 2.5 hole 1.8: 1(-2.5,5) 2(2.5,5)
  round 1.8 hole 1.1: 3(5.5,-5) 4(-5.5,-5)
CONN-TH_XT30U-M
  round 3.8 hole 2.54: 1(-2.5,0) 2(2.5,0)
DC-DC MINI 560
  round 1.524 hole 0.914: 1(-10.16,10.16) 2(-10.16,7.62) 3(-10.16,-0.508) 4(-10.16,-3.048) 5(15.24,10.16) 6(15.24,7.62) 7(15.24,-0.508) 8(15.24,-3.048)
STM32F103C8T6
  round 1.575 hole 0.914: 1(-7.62,24.13) 2(-7.62,21.59) 3(-7.62,19.05) 4(-7.62,16.51) 5(-7.62,13.97) 6(-7.62,11.43) 7(-7.62,8.89) 8(-7.62,6.35) 9(-7.62,3.81) 10(-7.62,1.27) 11(-7.62,-1.27) 12(-7.62,-3.81) 13(-7.62,-6.35) 14(-7.62,-8.89) 15(-7.62,-11.43) 16(-7.62,-13.97) 17(-7.62,-16.51) 18(-7.62,-19.05) 19(-7.62,-21.59) 20(-7.62,-24.13) 21(7.62,24.13) 22(7.62,21.59) 23(7.62,19.05) 24(7.62,16.51) 25(7.62,13.97) 26(7.62,11.43) 27(7.62,8.89) 28(7.62,6.35) 29(7.62,3.81) 30(7.62,1.27) 31(7.62,-1.27) 32(7.62,-3.81) 33(7.62,-6.35) 34(7.62,-8.89) 35(7.62,-11.43) 36(7.62,-13.97) 37(7.62,-16.51) 38(7.62,-19.05) 39(7.62,-21.59) 40(7.62,-24.13)
陀螺仪模块（串口）
  round 1.524 hole 0.914: 1(-5.08,7.62) 2(-5.08,5.08) 3(-5.08,2.54) 4(-5.08,0) 5(7.62,7.62) 6(7.62,5.08) 7(7.62,2.54) 8(7.62,0)

## Nets
+5V: U1.7 U1.8 U2.1 U4.18 W1.4 W2.4 W3.4 W4.4 W5.4
+12V: CN1.2 CN3.1 J1.2 U1.3 U1.4 W1.1 W2.1 W3.1 W4.1
+12VON: J1.1 W5.1
GND: CN1.1 CN1.3 CN1.4 CN3.2 H11.4 H12.3 U1.1 U1.2 U1.5 U1.6 U2.4 U4.19 U4.21 U4.22 W1.2 W2.2 W3.2 W4.2 W5.2
DIR1: U4.26 W1.6
DIR2: U4.3 W2.6
DIR3: U4.25 W3.6
DIR4: U4.2 W4.6
DIR5: U4.1 W5.6
I/O: H11.1 U4.4
RX1: H12.2 U4.15
RX2: H11.3 U4.33
RX3: U2.3 U4.16
STP1: U4.36 W1.5 W2.5 W3.5 W4.5
STP2: U4.35 W5.5
TX1: H12.1 U4.14
TX2: H11.2 U4.34
TX3: U2.2 U4.17

Pads without a net: U2 5 6 7 8; U4 5 6 7 8 9 10 11 12 13 20 23 24 27 28 29 30 31 32 37 38 39 40; W1 3; W2 3; W3 3; W4 3; W5 3

## Via types
v1: diameter 0.61, hole 0.305, Top Layer to Bottom Layer, 2 vias

## Routing (per net, layer and track width the routed paths; a pad name or vN(x,y) marks a point on that pad's centre or on a via; arc(x,y) is an arc through that point)
+5V: length 185.1
  Top Layer w0.508: W3.4 12.33,43.79 W1.4 ; W2.4 56.25,42.17 U1.8 ; U2.1 49.91,74.04 U4.18 39.88,70.1 39.88,56.01 U1.7 52.3,40.23 v1(52.3,12.33)
  Bottom Layer w0.508: W3.4 15.28,10.53 23.03,2.78 34.12,2.78 W5.4 43.68,12.33 v1(52.3,12.33) W4.4 ; U1.8 U1.7
+12V: length 141.1
  Top Layer w0.762: U1.4 56.51,32.86 61.64,37.98 W2.1 ; U1.3 53.97,12.02 v1(53.27,11.32) ; W1.1 15.92,27.22 15.11,26.42 15.11,20.55 J1.2
  Bottom Layer w0.762: v1(53.27,11.32) 52.66,10.7 W4.1 ; CN3.1 41.4,29.42 CN1.2 ; CN3.1 26.71,14.73 20.43,14.73 J1.2 11.32,20.3 W3.1 ; CN3.1 38.14,19.99 50.5,19.99 U1.3 U1.4
+12VON: length 19.9
  Bottom Layer w0.762: J1.1 14.86,15.99 26.66,4.19 ; W5.1 26.66,4.19
GND: length 201.8
  Top Layer w0.762: CN1.1 45.85,23.36 U1.2 46.68,16.51 W4.2 ; U4.19 36.58,77.22 U2.4 ; CN1.4 CN1.3 59.84,37.48 W2.2 ; U4.22 U4.21 20.7,21.78 H11.4 26.16,8.57 W5.2
  Bottom Layer w0.762: U4.22 14.12,39.98 W1.2 ; W2.2 47.72,43.79 U1.6 U1.5 ; U1.2 U1.1 35.83,16.51 ; U4.19 29.63,76.58 H12.3 ; CN1.1 51.78,24.42 CN1.4 ; H11.4 20.89,16.32 15.49,21.72 10.7,21.72 5.48,16.5 5.48,15.34 6.69,14.12 W3.2 ; 35.83,16.51 35.83,9.49 W5.2 ; 35.83,16.51 35.83,17.29 CN3.2
DIR1: length 27.2
  Bottom Layer w0.254: U4.26 19.05,45.21 19.05,50.67 16.89,52.83 14.48,52.83 6.94,45.29 W1.6
DIR2: length 23.1
  Bottom Layer w0.254: W2.6 50.71,50.97 35.94,36.2 U4.3
DIR3: length 36.1
  Top Layer w0.254: W3.6 18.8,9.81 18.8,39.12 U4.25
DIR4: length 33.1
  Bottom Layer w0.254: U4.2 44.49,33.4 61.64,16.25 W4.6
DIR5: length 28.6
  Top Layer w0.254: W5.6 40.54,26.26 U4.1
I/O: length 18.7
  Bottom Layer w0.254: U4.4 26.16,28.7 H11.1
RX1: length 10
  Bottom Layer w0.254: U4.15 35.94,66.67 H12.2
RX2: length 44.8
  Top Layer w0.254: U4.33 24,58.04 24,20.97 H11.3
RX3: length 15.5
  Bottom Layer w0.254: U4.16 39.75,68.96 U2.3
STP1: length 152.1
  Top Layer w0.254: W2.5 55.05,48.58 55.05,36.04 53.47,34.47 53.47,20.2 55.25,18.43 55.25,16.2 57.32,14.12 W4.5 ; U4.36 18.41,66.67 18.41,56.9 8.74,47.22 W1.5 9.94,42.59 9.94,13.53 9.31,12.9 9.31,11.75 12.33,8.74 W3.5
  Bottom Layer w0.254: U4.36 27.05,62.61 42.89,62.61 54.46,51.05 W2.5
STP2: length 69.4
  Top Layer w0.254: W5.5 29.8,12.43 29.8,57.32 U4.35
TX1: length 11.5
  Top Layer w0.254: H12.1 31.58,68.24 U4.14
TX2: length 44.8
  Top Layer w0.254: U4.34 24.76,59.82 24.76,22.71 H11.2
TX3: length 19.6
  Bottom Layer w0.254: U2.2 48.77,78.99 44.96,78.99 43.56,77.6 43.56,75.69 39.37,71.5 U4.17

## Copper pours and planes (outline as drawn; the poured copper is in the pictures)
GND on Top Layer: -5.84,84.45 69.72,84.45 71.25,82.93 71.25,-1.91 67.82,-5.33 -5.33,-5.33 -6.22,-4.44 -6.35,-4.44
GND on Bottom Layer: -6.73,89.03 76.45,89.03 77.34,88.14 77.34,-4.06 75.95,-5.46 -5.33,-5.46 -9.02,-1.78

Small or netless copper shapes (teardrops, artwork), in the pictures only: 21 on Top Layer, 28 on Bottom Layer

## Text on the board
Top Silkscreen Layer: T | G | R | IO | 开关 | 工创赛2023（下板）1.0
